# Altium schematic sheet SW3 Panel.SchDoc
size C; SheetNumber: 1; SheetTotal: 1
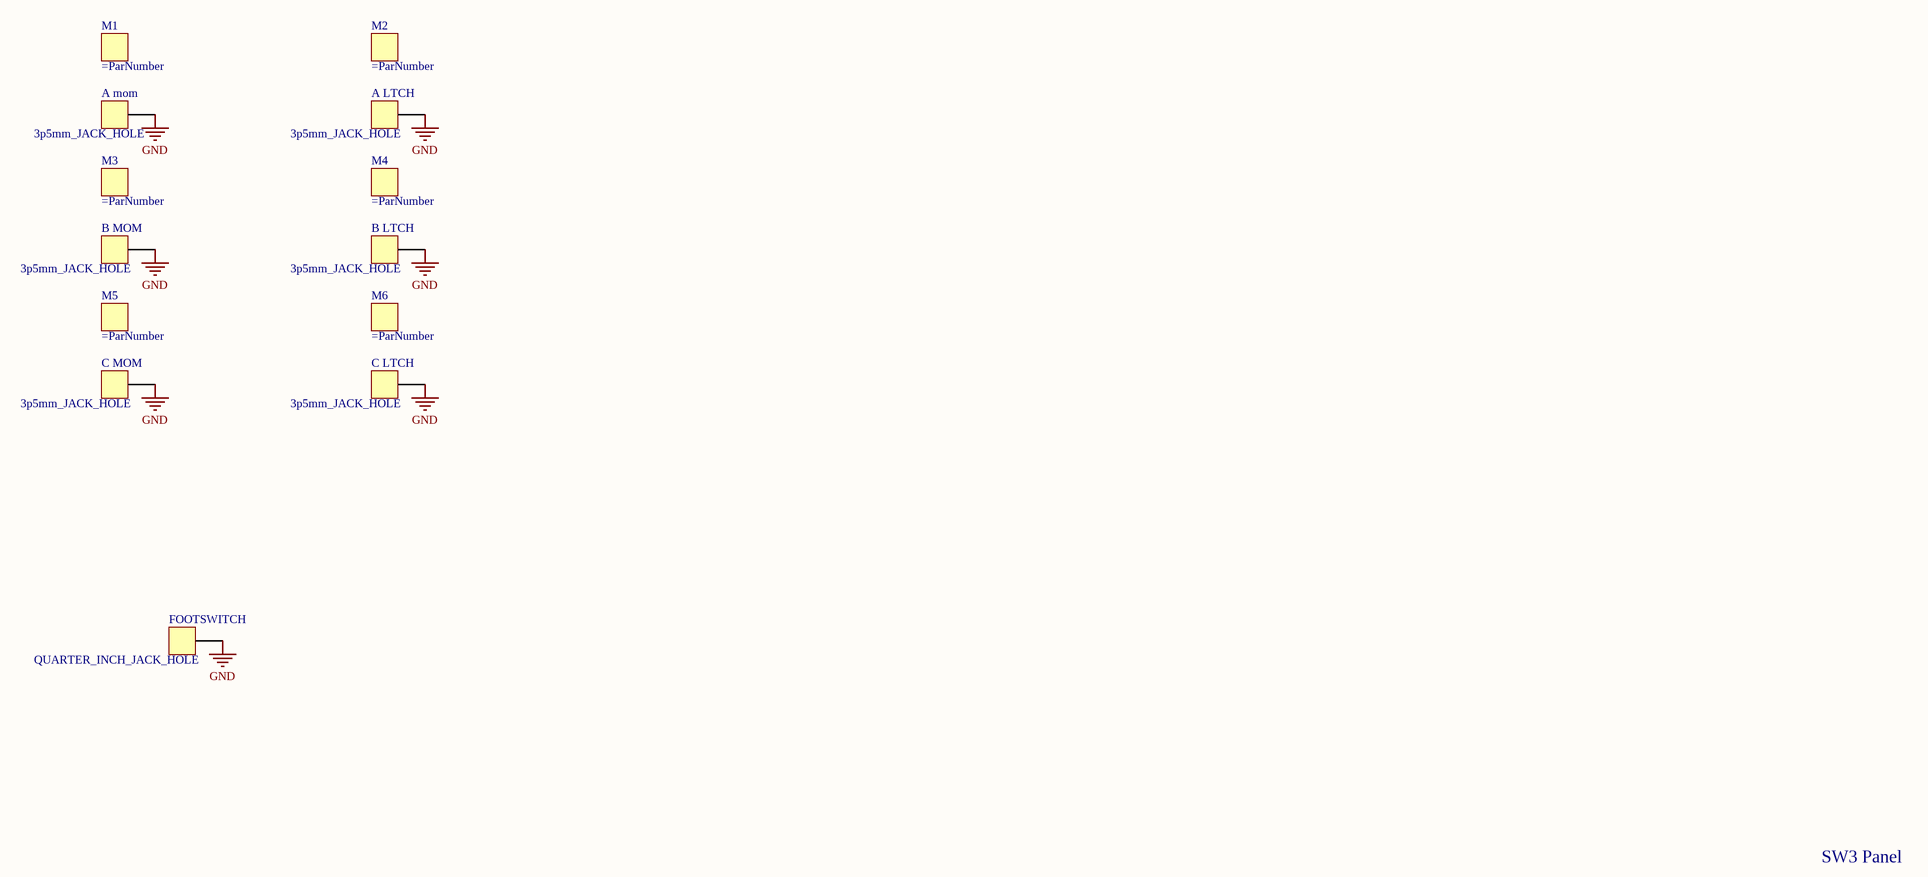
[diagram p0: SW3 Panel.SchDoc]

## Parts
A_LTCH  3p5mm_JACK_HOLE  [3p5mm_JACK_HOLE]
A_mom  3p5mm_JACK_HOLE  [3p5mm_JACK_HOLE]
B_LTCH  3p5mm_JACK_HOLE  [3p5mm_JACK_HOLE]
B_MOM  3p5mm_JACK_HOLE  [3p5mm_JACK_HOLE]
C_LTCH  3p5mm_JACK_HOLE  [3p5mm_JACK_HOLE]
C_MOM  3p5mm_JACK_HOLE  [3p5mm_JACK_HOLE]
FOOTSWITCH  QUARTER_INCH_JACK_HOLE  [QUARTER_INCH_JACK_HOLE]
M1  (no value)  [3mm_LED_HOLE]
M2  (no value)  [3mm_LED_HOLE]
M3  (no value)  [3mm_LED_HOLE]
M4  (no value)  [3mm_LED_HOLE]
M5  (no value)  [3mm_LED_HOLE]
M6  (no value)  [3mm_LED_HOLE]

## Nets
GND: A_LTCH.1 A_mom.1 B_LTCH.1 B_MOM.1 C_LTCH.1 C_MOM.1 FOOTSWITCH.1

## Notes on the sheet
- SW3 Panel
- Title:
- This work is licensed under a Creative Commons Attribution 4.0 International License. Derivative works should remove all Sophistry branding and ‘é’ watermark.
- Date:
- Engineer:
- Revision:
- Codename:
- Time:
- Variant:
- Sheet
- of

## Library data of the parts
M1-M6 = 3mm_LED_HOLE: PartNumber: 3mm_LED_HOLE; Manufacturer Part Number: 3mm_LED_HOLE
A_LTCH A_mom B_LTCH B_MOM C_LTCH C_MOM = 3p5mm_JACK_HOLE: PartNumber: 3p5mm_JACK_HOLE; Manufacturer Part Number: 3p5mm_JACK_HOLE
FOOTSWITCH = QUARTER_INCH_JACK_HOLE: PartNumber: QUARTER_INCH_JACK_HOLE; Manufacturer Part Number: QUARTER_INCH_JACK_HOLE